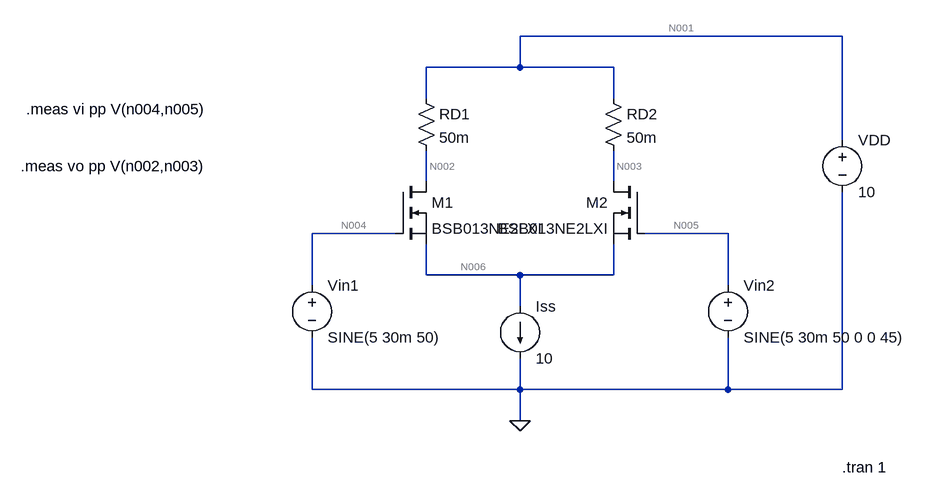
[diagram p0: schematic Draft1.asc]
Draft1.asc, the LTspice schematic file:
Version 4
SHEET 1 880 696
WIRE 688 16 192 16
WIRE 192 64 192 16
WIRE 192 64 48 64
WIRE 336 64 192 64
WIRE 48 112 48 64
WIRE 336 112 336 64
WIRE 688 176 688 16
WIRE 48 240 48 192
WIRE 336 240 336 192
WIRE 0 320 -128 320
WIRE 512 320 384 320
WIRE 48 384 48 336
WIRE 192 384 48 384
WIRE 336 384 336 336
WIRE 336 384 192 384
WIRE -128 400 -128 320
WIRE 512 400 512 320
WIRE 192 432 192 384
WIRE -128 560 -128 480
WIRE 192 560 192 512
WIRE 192 560 -128 560
WIRE 512 560 512 480
WIRE 512 560 192 560
WIRE 688 560 688 256
WIRE 688 560 512 560
WIRE 192 608 192 560
FLAG 192 608 0
SYMBOL res 32 96 R0
SYMATTR InstName RD1
SYMATTR Value 50m
SYMBOL res 320 96 R0
SYMATTR InstName RD2
SYMATTR Value 50m
SYMBOL nmos 0 240 R0
SYMATTR InstName M1
SYMATTR Value BSB013NE2LXI
SYMBOL voltage -128 384 R0
WINDOW 123 0 0 Left 0
WINDOW 39 0 0 Left 0
SYMATTR InstName Vin1
SYMATTR Value SINE(5 30m 50)
SYMBOL voltage 512 384 R0
WINDOW 123 0 0 Left 0
WINDOW 39 0 0 Left 0
SYMATTR InstName Vin2
SYMATTR Value SINE(5 30m 50 0 0 45)
SYMBOL voltage 688 160 R0
SYMATTR InstName VDD
SYMATTR Value 10
SYMBOL nmos 384 240 M0
SYMATTR InstName M2
SYMATTR Value BSB013NE2LXI
SYMBOL current 192 432 R0
WINDOW 123 0 0 Left 0
WINDOW 39 0 0 Left 0
SYMATTR InstName Iss
SYMATTR Value 10
TEXT 688 680 Left 2 !.tran 1
TEXT -568 128 Left 2 !.meas vi pp V(n004,n005)
TEXT -576 216 Left 2 !.meas vo pp V(n002,n003)

The netlist it stands for:
* Draft1.asc
RD1 N001 N002 50m
RD2 N001 N003 50m
M1 N002 N004 N006 N006 BSB013NE2LXI
Vin1 N004 0 SINE(5 30m 50)
Vin2 N005 0 SINE(5 30m 50 0 0 45)
VDD N001 0 10
M2 N003 N005 N006 N006 BSB013NE2LXI
Iss N006 0 10
.model NMOS NMOS
.model PMOS PMOS
.lib standard.mos
.tran 1
.meas vi pp V(n004,n005)
.meas vo pp V(n002,n003)
.backanno
.end

* Results of the author's LTspice run, read from the files saved beside the schematic
* Operating Point, zero values left out:
*   V(n001) = 10 V
*   V(n002) = 9.785 V
*   V(n003) = 9.715 V
*   V(n004) = 5 V
*   V(n006) = 2.656 V
*   V(n005) = 5.021 V
*   Id(M1) = 4.296 A
*   Is(M1) = -4.296 A
*   Id(M2) = 5.704 A
*   Is(M2) = -5.704 A
*   I(Iss) = 10 A
*   I(Rd1) = 4.296 A
*   I(Rd2) = 5.704 A
*   I(Vdd) = -10 A
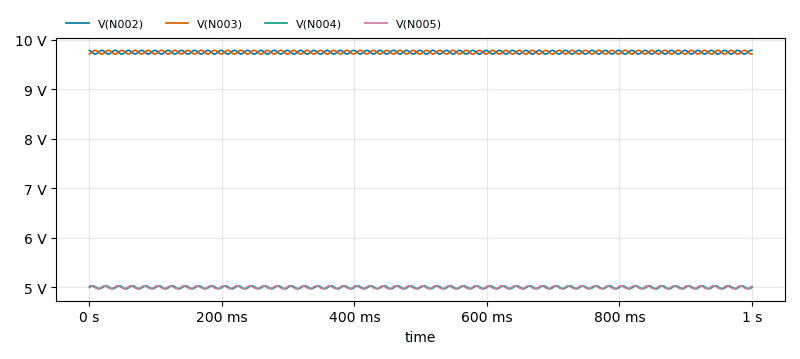
[diagram p1: Transient Analysis of Draft1.asc, plotted from the saved traces]
* Transient Analysis, 1 run:
*   V(N002): min 9.713 V, max 9.787 V, average 9.75 V, rms 9.75 V, last 9.785 V
*   V(N003): min 9.713 V, max 9.787 V, average 9.75 V, rms 9.75 V, last 9.715 V
*   V(N004): min 4.97 V, max 5.03 V, average 5 V, rms 5 V, last 5 V
*   V(N005): min 4.97 V, max 5.03 V, average 5 V, rms 5 V, last 5.021 V